# EAGLE schematic System_description (EAGLE 6.5.0)
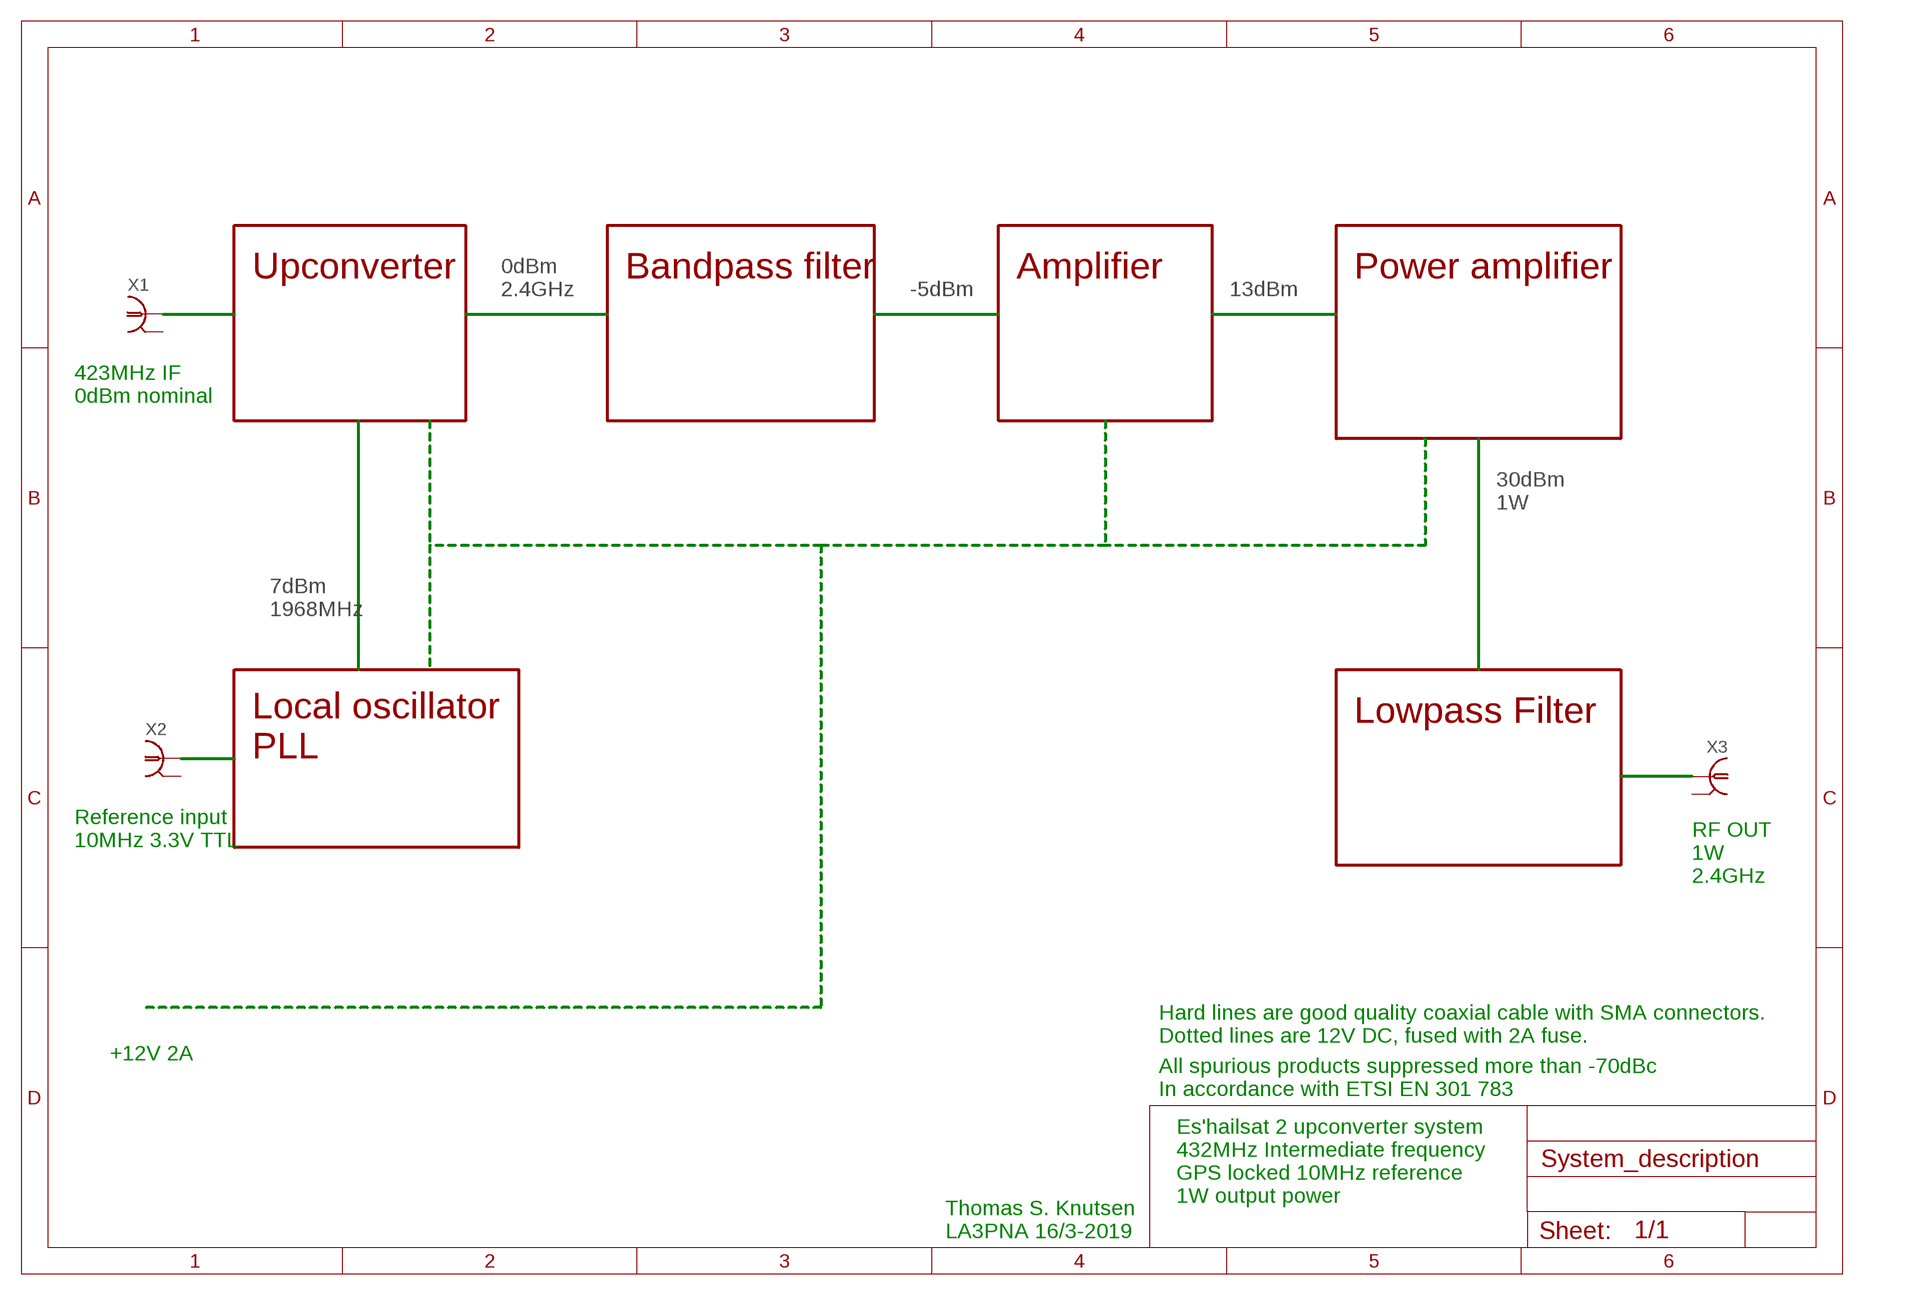
[diagram p0: schematic, sheet 1]

## Parts
X1  R141426  [R141426]
X2  R141426  [R141426]
X3  R141426  [R141426]

## Nets
N$1: X1.1
N$2: X2.1
N$8: X3.1
Unconnected: X1.2 X1.3 X1.4 X1.5 X2.2 X2.3 X2.4 X2.5 X3.2 X3.3 X3.4 X3.5

## Notes on the sheet
- Upconverter | Bandpass filter | Amplifier | Power amplifier
- 0dBm 
  2.4GHz
- -5dBm | 13dBm
- 423MHz IF
  0dBm nominal
- 30dBm
  1W
- 7dBm 
  1968MHz
- Lowpass Filter
- Local oscillator 
  PLL
- Reference input
  10MHz 3.3V TTL
- RF OUT
  1W
  2.4GHz
- Hard lines are good quality coaxial cable with SMA connectors.
  Dotted lines are 12V DC, fused with 2A fuse.
- +12V 2A
- All spurious products suppressed more than -70dBc
  In accordance with ETSI EN 301 783
- Es'hailsat 2 upconverter system
  432MHz Intermediate frequency
  GPS locked 10MHz reference
  1W output power
- Thomas S. Knutsen
  LA3PNA 16/3-2019

## Library data of the parts
X1-X3 = con-coax:R141426: BNC COAX CONNECTOR Radiall 50/75 Ohm Spoerle; MF: FARNELL; MPN: R141426161; OC_FARNELL: 4195115; OC_NEWARK: 14J7919